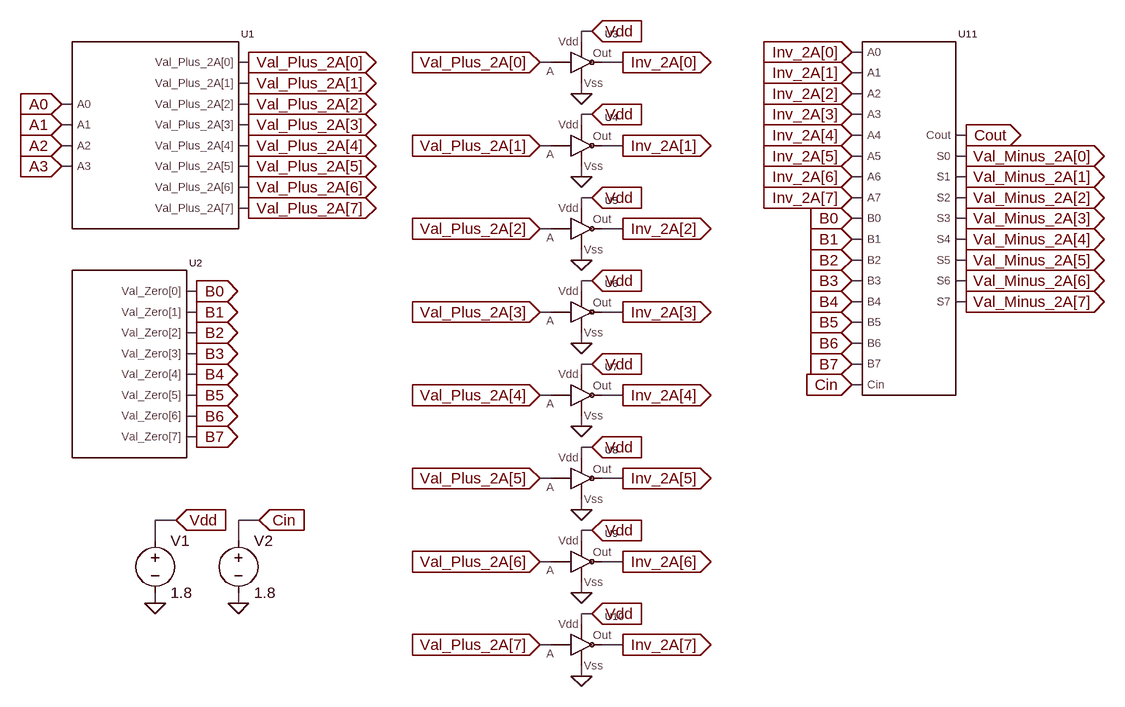
[diagram p0: schematic Val_Minus_2A.asc]
Val_Minus_2A.asc, the LTspice schematic file:
Version 4
SHEET 1 2292 1028
WIRE 880 -160 864 -160
WIRE 864 -144 864 -160
WIRE 1296 -128 1280 -128
WIRE 352 -112 336 -112
WIRE 816 -112 800 -112
WIRE 928 -112 896 -112
WIRE 1296 -96 1280 -96
WIRE 352 -80 336 -80
WIRE 864 -64 864 -80
WIRE 1296 -64 1280 -64
WIRE 80 -48 64 -48
WIRE 352 -48 336 -48
WIRE 880 -32 864 -32
WIRE 1296 -32 1280 -32
WIRE 80 -16 64 -16
WIRE 352 -16 336 -16
WIRE 864 -16 864 -32
WIRE 1296 0 1280 0
WIRE 1456 0 1440 0
WIRE 80 16 64 16
WIRE 352 16 336 16
WIRE 816 16 800 16
WIRE 928 16 896 16
WIRE 1296 32 1280 32
WIRE 1456 32 1440 32
WIRE 80 48 64 48
WIRE 352 48 336 48
WIRE 864 64 864 48
WIRE 1296 64 1280 64
WIRE 1456 64 1440 64
WIRE 352 80 336 80
WIRE 880 96 864 96
WIRE 1296 96 1280 96
WIRE 1456 96 1440 96
WIRE 352 112 336 112
WIRE 864 112 864 96
WIRE 1296 128 1280 128
WIRE 1456 128 1440 128
WIRE 816 144 800 144
WIRE 928 144 896 144
WIRE 1296 160 1280 160
WIRE 1456 160 1440 160
WIRE 864 192 864 176
WIRE 1296 192 1280 192
WIRE 1456 192 1440 192
WIRE 880 224 864 224
WIRE 1296 224 1280 224
WIRE 1456 224 1440 224
WIRE 272 240 256 240
WIRE 864 240 864 224
WIRE 1296 256 1280 256
WIRE 1456 256 1440 256
WIRE 272 272 256 272
WIRE 816 272 800 272
WIRE 928 272 896 272
WIRE 1296 288 1280 288
WIRE 272 304 256 304
WIRE 864 320 864 304
WIRE 1296 320 1280 320
WIRE 272 336 256 336
WIRE 880 352 864 352
WIRE 1296 352 1280 352
WIRE 272 368 256 368
WIRE 864 368 864 352
WIRE 1296 384 1280 384
WIRE 272 400 256 400
WIRE 816 400 800 400
WIRE 928 400 896 400
WIRE 272 432 256 432
WIRE 864 448 864 432
WIRE 272 464 256 464
WIRE 880 480 864 480
WIRE 864 496 864 480
WIRE 816 528 800 528
WIRE 928 528 896 528
WIRE 864 576 864 560
WIRE 240 592 208 592
WIRE 368 592 336 592
WIRE 880 608 864 608
WIRE 208 624 208 592
WIRE 336 624 336 592
WIRE 864 624 864 608
WIRE 816 656 800 656
WIRE 928 656 896 656
WIRE 864 704 864 688
WIRE 208 720 208 704
WIRE 336 720 336 704
WIRE 880 736 864 736
WIRE 864 752 864 736
WIRE 816 784 800 784
WIRE 928 784 896 784
WIRE 864 832 864 816
FLAG 64 -48 A0
IOPIN 64 -48 In
FLAG 64 -16 A1
IOPIN 64 -16 In
FLAG 64 16 A2
IOPIN 64 16 In
FLAG 64 48 A3
IOPIN 64 48 In
FLAG 352 -112 Val_Plus_2A[0]
IOPIN 352 -112 Out
FLAG 352 -80 Val_Plus_2A[1]
IOPIN 352 -80 Out
FLAG 352 -48 Val_Plus_2A[2]
IOPIN 352 -48 Out
FLAG 352 -16 Val_Plus_2A[3]
IOPIN 352 -16 Out
FLAG 352 16 Val_Plus_2A[4]
IOPIN 352 16 Out
FLAG 352 48 Val_Plus_2A[5]
IOPIN 352 48 Out
FLAG 352 80 Val_Plus_2A[6]
IOPIN 352 80 Out
FLAG 352 112 Val_Plus_2A[7]
IOPIN 352 112 Out
FLAG 272 240 B0
IOPIN 272 240 Out
FLAG 272 272 B1
IOPIN 272 272 Out
FLAG 272 304 B2
IOPIN 272 304 Out
FLAG 272 336 B3
IOPIN 272 336 Out
FLAG 272 368 B4
IOPIN 272 368 Out
FLAG 272 432 B6
IOPIN 272 432 Out
FLAG 272 464 B7
IOPIN 272 464 Out
FLAG 272 400 B5
IOPIN 272 400 Out
FLAG 208 720 0
FLAG 336 720 0
FLAG 240 592 Vdd
IOPIN 240 592 In
FLAG 368 592 Cin
IOPIN 368 592 In
FLAG 880 -160 Vdd
IOPIN 880 -160 In
FLAG 864 -64 0
FLAG 800 -112 Val_Plus_2A[0]
IOPIN 800 -112 In
FLAG 928 -112 Inv_2A[0]
IOPIN 928 -112 Out
FLAG 880 -32 Vdd
IOPIN 880 -32 In
FLAG 864 64 0
FLAG 800 16 Val_Plus_2A[1]
IOPIN 800 16 In
FLAG 928 16 Inv_2A[1]
IOPIN 928 16 Out
FLAG 880 96 Vdd
IOPIN 880 96 In
FLAG 864 192 0
FLAG 800 144 Val_Plus_2A[2]
IOPIN 800 144 In
FLAG 928 144 Inv_2A[2]
IOPIN 928 144 Out
FLAG 880 224 Vdd
IOPIN 880 224 In
FLAG 864 320 0
FLAG 800 272 Val_Plus_2A[3]
IOPIN 800 272 In
FLAG 928 272 Inv_2A[3]
IOPIN 928 272 Out
FLAG 880 352 Vdd
IOPIN 880 352 In
FLAG 864 448 0
FLAG 800 400 Val_Plus_2A[4]
IOPIN 800 400 In
FLAG 928 400 Inv_2A[4]
IOPIN 928 400 Out
FLAG 880 480 Vdd
IOPIN 880 480 In
FLAG 864 576 0
FLAG 800 528 Val_Plus_2A[5]
IOPIN 800 528 In
FLAG 928 528 Inv_2A[5]
IOPIN 928 528 Out
FLAG 880 608 Vdd
IOPIN 880 608 In
FLAG 864 704 0
FLAG 800 656 Val_Plus_2A[6]
IOPIN 800 656 In
FLAG 928 656 Inv_2A[6]
IOPIN 928 656 Out
FLAG 880 736 Vdd
IOPIN 880 736 In
FLAG 864 832 0
FLAG 800 784 Val_Plus_2A[7]
IOPIN 800 784 In
FLAG 928 784 Inv_2A[7]
IOPIN 928 784 Out
FLAG 1280 -128 Inv_2A[0]
IOPIN 1280 -128 In
FLAG 1280 -96 Inv_2A[1]
IOPIN 1280 -96 In
FLAG 1280 -64 Inv_2A[2]
IOPIN 1280 -64 In
FLAG 1280 -32 Inv_2A[3]
IOPIN 1280 -32 In
FLAG 1280 0 Inv_2A[4]
IOPIN 1280 0 In
FLAG 1280 32 Inv_2A[5]
IOPIN 1280 32 In
FLAG 1280 64 Inv_2A[6]
IOPIN 1280 64 In
FLAG 1280 96 Inv_2A[7]
IOPIN 1280 96 In
FLAG 1280 128 B0
IOPIN 1280 128 In
FLAG 1280 160 B1
IOPIN 1280 160 In
FLAG 1280 192 B2
IOPIN 1280 192 In
FLAG 1280 224 B3
IOPIN 1280 224 In
FLAG 1280 256 B4
IOPIN 1280 256 In
FLAG 1280 320 B6
IOPIN 1280 320 In
FLAG 1280 352 B7
IOPIN 1280 352 In
FLAG 1280 288 B5
IOPIN 1280 288 In
FLAG 1280 384 Cin
IOPIN 1280 384 In
FLAG 1456 0 Cout
IOPIN 1456 0 Out
FLAG 1456 32 Val_Minus_2A[0]
IOPIN 1456 32 Out
FLAG 1456 64 Val_Minus_2A[1]
IOPIN 1456 64 Out
FLAG 1456 96 Val_Minus_2A[2]
IOPIN 1456 96 Out
FLAG 1456 128 Val_Minus_2A[3]
IOPIN 1456 128 Out
FLAG 1456 160 Val_Minus_2A[4]
IOPIN 1456 160 Out
FLAG 1456 192 Val_Minus_2A[5]
IOPIN 1456 192 Out
FLAG 1456 224 Val_Minus_2A[6]
IOPIN 1456 224 Out
FLAG 1456 256 Val_Minus_2A[7]
IOPIN 1456 256 Out
SYMBOL Val_Plus_2A 160 0 R0
SYMATTR InstName U1
SYMBOL Val_Zero 240 304 R0
SYMATTR InstName U2
SYMBOL voltage 208 608 R0
WINDOW 123 0 0 Left 0
WINDOW 39 0 0 Left 0
SYMATTR InstName V1
SYMATTR Value 1.8
SYMBOL voltage 336 608 R0
WINDOW 123 0 0 Left 0
WINDOW 39 0 0 Left 0
SYMATTR InstName V2
SYMATTR Value 1.8
SYMBOL NOT1 848 -112 R0
SYMATTR InstName U3
SYMBOL NOT1 848 16 R0
SYMATTR InstName U4
SYMBOL NOT1 848 144 R0
SYMATTR InstName U5
SYMBOL NOT1 848 272 R0
SYMATTR InstName U6
SYMBOL NOT1 848 400 R0
SYMATTR InstName U7
SYMBOL NOT1 848 528 R0
SYMATTR InstName U8
SYMBOL NOT1 848 656 R0
SYMATTR InstName U9
SYMBOL NOT1 848 784 R0
SYMATTR InstName U10
SYMBOL 8_Bit_CLA 1376 128 R0
SYMATTR InstName U11

The netlist it stands for:
* Val_Minus_2A.asc
XU1 A0 A1 A2 A3 Val_Plus_2A[0] Val_Plus_2A[1] Val_Plus_2A[2] Val_Plus_2A[3] Val_Plus_2A[4] Val_Plus_2A[5] Val_Plus_2A[6] Val_Plus_2A[7] Val_Plus_2A  ; pins A0 A1 A2 A3 Val_Plus_2A[0] Val_Plus_2A[1] Val_Plus_2A[2] Val_Plus_2A[3] Val_Plus_2A[4] Val_Plus_2A[5] Val_Plus_2A[6] Val_Plus_2A[7]
XU2 B0 B1 B2 B3 B4 B5 B6 B7 Val_Zero  ; pins Val_Zero[0] Val_Zero[1] Val_Zero[2] Val_Zero[3] Val_Zero[4] Val_Zero[5] Val_Zero[6] Val_Zero[7]
V1 Vdd 0 1.8
V2 Cin 0 1.8
XU3 Vdd 0 Val_Plus_2A[0] Inv_2A[0] NOT1  ; pins Vdd Vss A Out
XU4 Vdd 0 Val_Plus_2A[1] Inv_2A[1] NOT1  ; pins Vdd Vss A Out
XU5 Vdd 0 Val_Plus_2A[2] Inv_2A[2] NOT1  ; pins Vdd Vss A Out
XU6 Vdd 0 Val_Plus_2A[3] Inv_2A[3] NOT1  ; pins Vdd Vss A Out
XU7 Vdd 0 Val_Plus_2A[4] Inv_2A[4] NOT1  ; pins Vdd Vss A Out
XU8 Vdd 0 Val_Plus_2A[5] Inv_2A[5] NOT1  ; pins Vdd Vss A Out
XU9 Vdd 0 Val_Plus_2A[6] Inv_2A[6] NOT1  ; pins Vdd Vss A Out
XU10 Vdd 0 Val_Plus_2A[7] Inv_2A[7] NOT1  ; pins Vdd Vss A Out
XU11 Inv_2A[0] Inv_2A[1] Inv_2A[2] Inv_2A[3] Inv_2A[4] Inv_2A[5] Inv_2A[6] Inv_2A[7] B0 B1 B2 B3 B4 B5 B6 B7 Cin Cout Val_Minus_2A[0] Val_Minus_2A[1] Val_Minus_2A[2] Val_Minus_2A[3] Val_Minus_2A[4] Val_Minus_2A[5] Val_Minus_2A[6] Val_Minus_2A[7] 8_Bit_CLA  ; pins A0 A1 A2 A3 A4 A5 A6 A7 B0 B1 B2 B3 B4 B5 B6 B7 Cin Cout S0 S1 S2 S3 S4 S5 S6 S7
.lib Val_Plus_2A.sub
.lib Val_Zero.sub
.lib NOT1.sub
.lib 8_Bit_CLA.sub
.backanno
.end